# Altium schematic sheet Sheet2Viper.SchDoc
size A
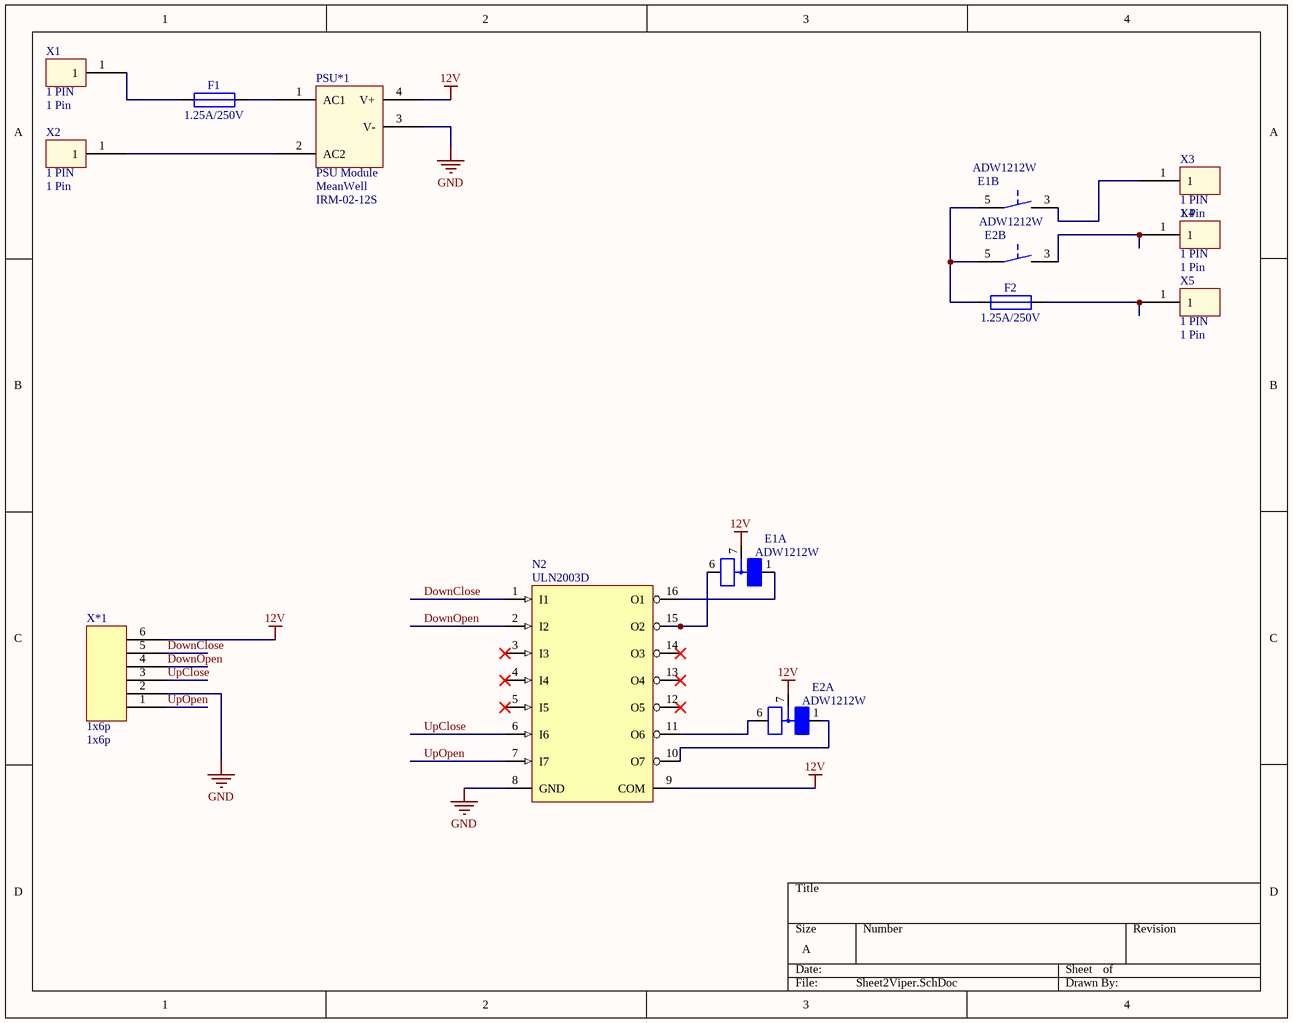
[diagram p0: Sheet2Viper.SchDoc]

## Parts
E1  ADW1212W  [RELAIS_PANASONIC_ADW1212W]  (parts A,B of 2)
E2  ADW1212W  [RELAIS_PANASONIC_ADW1212W]  (parts A,B of 2)
F1  1.25A/250V  [FUSE_THT_8.4x4]
F2  1.25A/250V  [FUSE_THT_8.4x4]
N2  ULN2003D  [SOP127P720X175-16N]
PSU*1  PSU Module  Manufacturer: MeanWell  Manufacturer Code: IRM-02-12S  [MeanWell Psu]
X1  1 PIN  [1p]
X2  1 PIN  [1p]
X3  1 PIN  [1p]
X4  1 PIN  [1p]
X5  1 PIN  [1p]
X*1  1x6p  [1x6p]

## Nets
12V: E1.7(P) E2.7(P) N2.9(COM) PSU*1.4(V+) X*1.6
GND: N2.8(GND) PSU*1.3(V-) X*1.2
DownClose: N2.1(I1) X*1.5
DownOpen: N2.2(I2) X*1.4
UpClose: N2.6(I6) X*1.3
UpOpen: N2.7(I7) X*1.1
NetE1_1: E1.1(M) N2.16(O1)
NetE1_3: E1.3 X3.1
NetE1_5: E1.5 E2.5 F2.1
NetE1_6: E1.6(M1) N2.15(O2)
NetE2_1: E2.1(M) N2.10(O7)
NetE2_3: E2.3 X4.1
NetE2_6: E2.6(M1) N2.11(O6)
NetF1_1: F1.1 X1.1
NetF1_2: F1.2 PSU*1.1(AC1)
NetF2_2: F2.2 X5.1
NetPSU*1_2: PSU*1.2(AC2) X2.1

Not connected (* = marked no-connect by the designer): N2 3(I3)* 4(I4)* 5(I5)* 12(O5)* 13(O4)* 14(O3)*

## Library data of the parts
E1 E2 = ADW1212W_04-3960: 04-3960 - Relais, 12V, 1S 2Coils; PcbLib: Relais.PcbLib; Prüfstatus: zu prüfen; Partnumber: 04-3960; LatestRevisionDate: *; LatestRevisionNote: *; Publisher: SS; Published: 26.07.2013
F1 F2 = Fuse_1.25A_250V_04-3586: 04-3586 - Fuse 1.25A 250V THT 8.4x4mm RM5.08mm; PcbLib: Fuse.PcbLib; Prüfstatus: geprüft; Partnumber: 04-3586; LatestRevisionDate: *; LatestRevisionNote: *; Publisher: SS; Published: 04.04.2014; Strom: 1.25A
N2 = ULN2003D_11-0373: 11-0373- High-Voltage, High-Current Darlington Transistor Arrays, SOP16; PcbLib: SO, QSOP, MSOP.PcbLib; Prüfstatus: geprüft; Partnumber: 11-0373; LatestRevisionDate: *; LatestRevisionNote: *; Publisher: SS; Published: 22.07.2013; PackageDescription: SO16
PSU*1 = PSU Module: SMPS PCB Mode; Distribuitor: Mouser; Distribuitor Code: 709-IRM02-12S
X*1 = 1x6p: Manufacturer: TI; Distribuitor: Mouser; Distribuitor Code: 926-LM3671MF-3.3NOPB; Manufacturer Code: 1x6p
X1-X5 = 1 PIN: 1: 1 Pin